# EasyEDA Pro project 转接板_v1_2024-09-18.eprj

# Schematic Schematic1
Create Date: 2024-09-18; Page Name: P1; Project Name: 转接板_v1_2024-09-18; Schematic Name: Schematic1; Update Date: 2024-09-18; Company: 嘉立创EDA; Page Size: A4; Version: V1.0
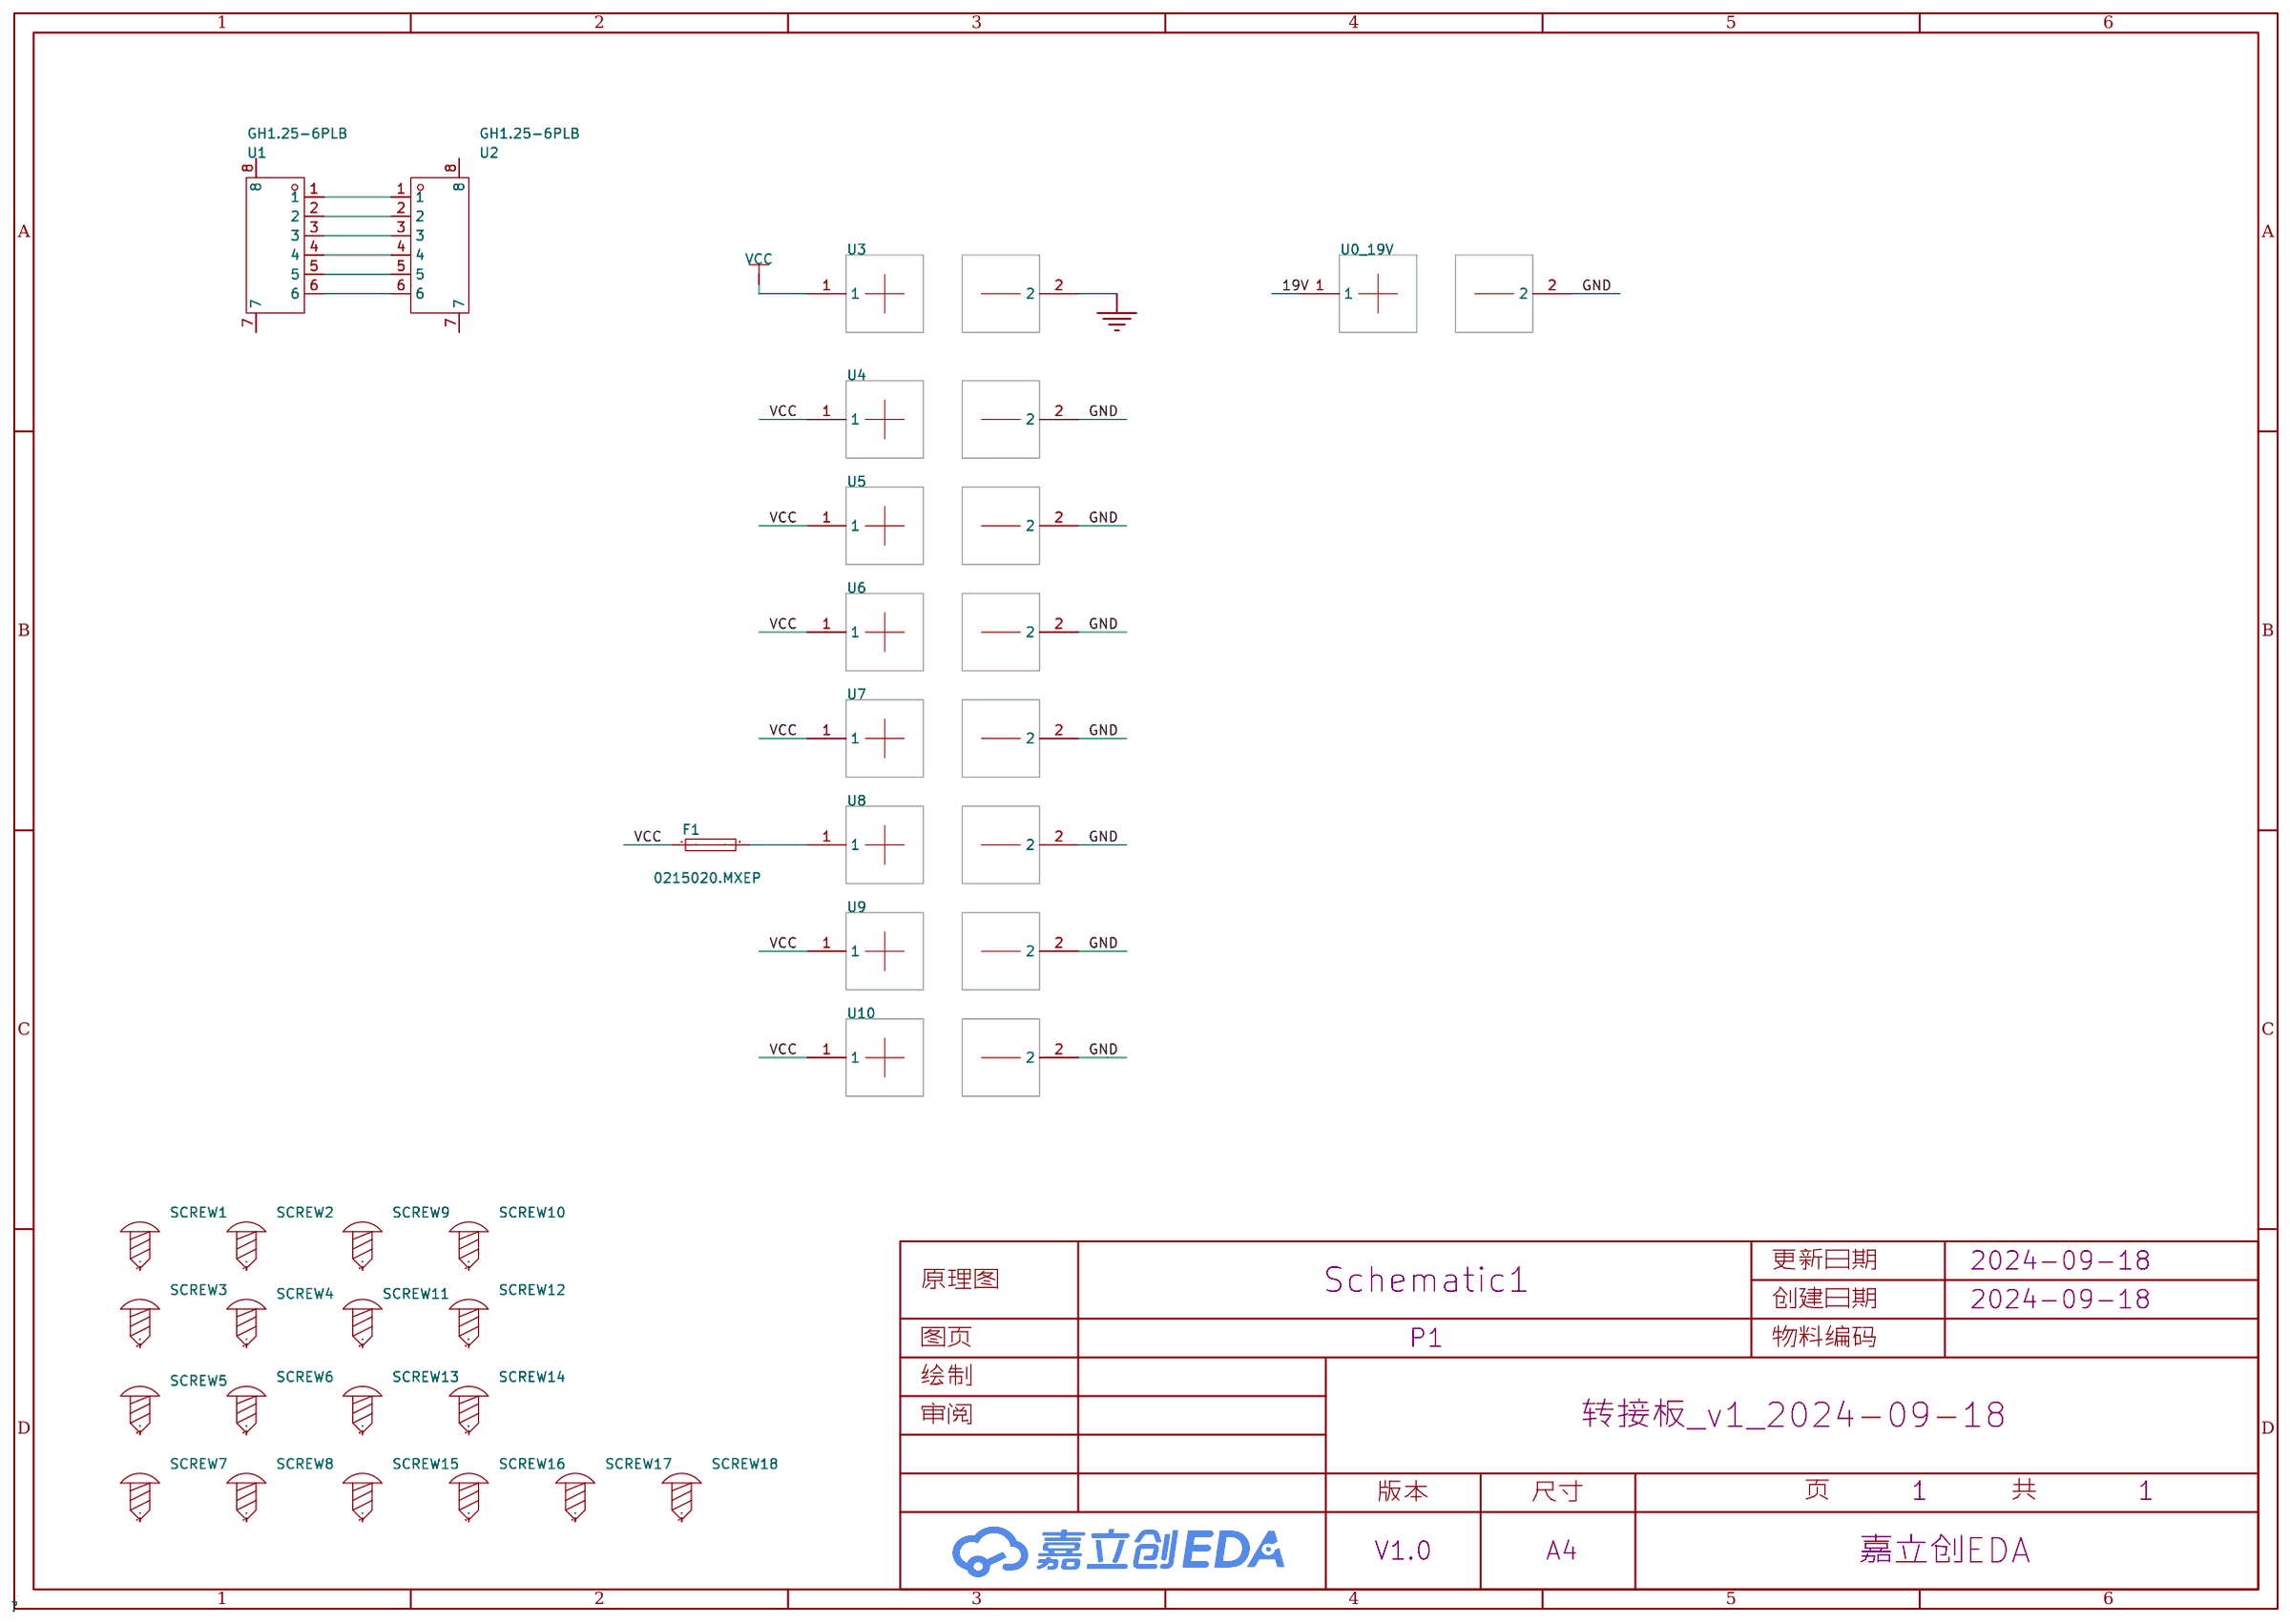
[diagram p0: schematic sheet]

## Parts
F1  0215020.MXEP  [FUSE-TH_BD5.5-L21.5-P25.50-D1.2]
SCREW1  -  [M3螺丝]
SCREW2  -  [M3螺丝]
SCREW3  -  [M3螺丝]
SCREW4  -  [M3螺丝]
SCREW5  -  [M3螺丝]
SCREW6  -  [M3螺丝]
SCREW7  -  [M3螺丝]
SCREW8  -  [M3螺丝]
SCREW9  -  [M3螺丝]
SCREW10  -  [M3螺丝]
SCREW11  -  [M3螺丝]
SCREW12  -  [M3螺丝]
SCREW13  -  [M3螺丝]
SCREW14  -  [M3螺丝]
SCREW15  -  [M3螺丝]
SCREW16  -  [M3螺丝]
SCREW17  -  [M3螺丝]
SCREW18  -  [M3螺丝]
U0_19V  -  [111]
U1  GH1.25-6PLB  [CONN-SMD_6P-P1.25_XUNPU_WAFER-GH1.25-6PLB]
U2  GH1.25-6PLB  [CONN-SMD_6P-P1.25_XUNPU_WAFER-GH1.25-6PLB]
U3  -  [111]
U4  -  [111]
U5  -  [111]
U6  -  [111]
U7  -  [111]
U8  -  [111]
U9  -  [111]
U10  -  [111]

## Library data of the parts
F1 = 0215020.MXEP: 类型:陶瓷管保险丝;额定电流:20A;; LCSC Part Name: 陶瓷管保险丝; Supplier Part: C151079; Manufacturer: Littelfuse(美国力特); Supplier Footprint: 插件,D5.8xL22.5mm; Datasheet: https://atta.szlcsc.com/upload/public/pdf/source/20180418/C178844_15D2AB09A5C0B365E956DEBA04888CB0.pdf; Supplier: LCSC; Type: 陶瓷管保险丝; Current Rating: 20A
SCREW1-SCREW18 = M3螺丝: Supplier Footprint: 插件
U0_19V U3-U10 = 111
U1 U2 = WAFER-GH1.25-6PLB: 插针结构:1x6P;间距:1.25mm;安装方式:立贴;参考系列:GH;总PIN数:6P;排数:1;每排PIN数:6;额定电流:1A;工作温度范围:-25℃~+85℃;; LCSC Part Name: 1x6P 间距:1.25mm 立贴 系列:GH; Supplier Part: C3029372; Manufacturer: XUNPU(讯普); Supplier Footprint: SMD,P=1.25mm; Datasheet: https://atta.szlcsc.com/upload/public/pdf/source/20220527/44F824AAC8C2B617205E15955FF9C23D.pdf; Supplier: LCSC; Pins Structure: 1x6P; Pitch: 1.25mm; Mounting Style: 立贴; Reference Series: GH; Number of Pins: 6P; Number of Rows: 1; Number of PINs Per Row: 6; Current Rating (Max): 1A; Operating Temperature Range: -25℃~+85℃

## Nets
19V: U0_19V.1
GND: U0_19V.2 U3.2 U4.2 U5.2 U6.2 U7.2 U8.2 U9.2 U10.2
VCC: F1.1 U3.1 U4.1 U5.1 U6.1 U7.1 U9.1 U10.1
$1N1535: U1.6 U2.6
$1N1536: U1.1 U2.1
$1N1537: U1.2 U2.2
$1N1538: U1.3 U2.3
$1N1539: U1.4 U2.4
$1N1540: U1.5 U2.5
$1N1987: F1.2 U8.1

Not connected (* = marked no-connect by the designer): SCREW1 1; SCREW2 1; SCREW3 1; SCREW4 1; SCREW5 1; SCREW6 1; SCREW7 1; SCREW8 1; SCREW9 1; SCREW10 1; SCREW11 1; SCREW12 1; SCREW13 1; SCREW14 1; SCREW15 1; SCREW16 1; SCREW17 1; SCREW18 1; U1 7 8; U2 7 8

# Board PCB1
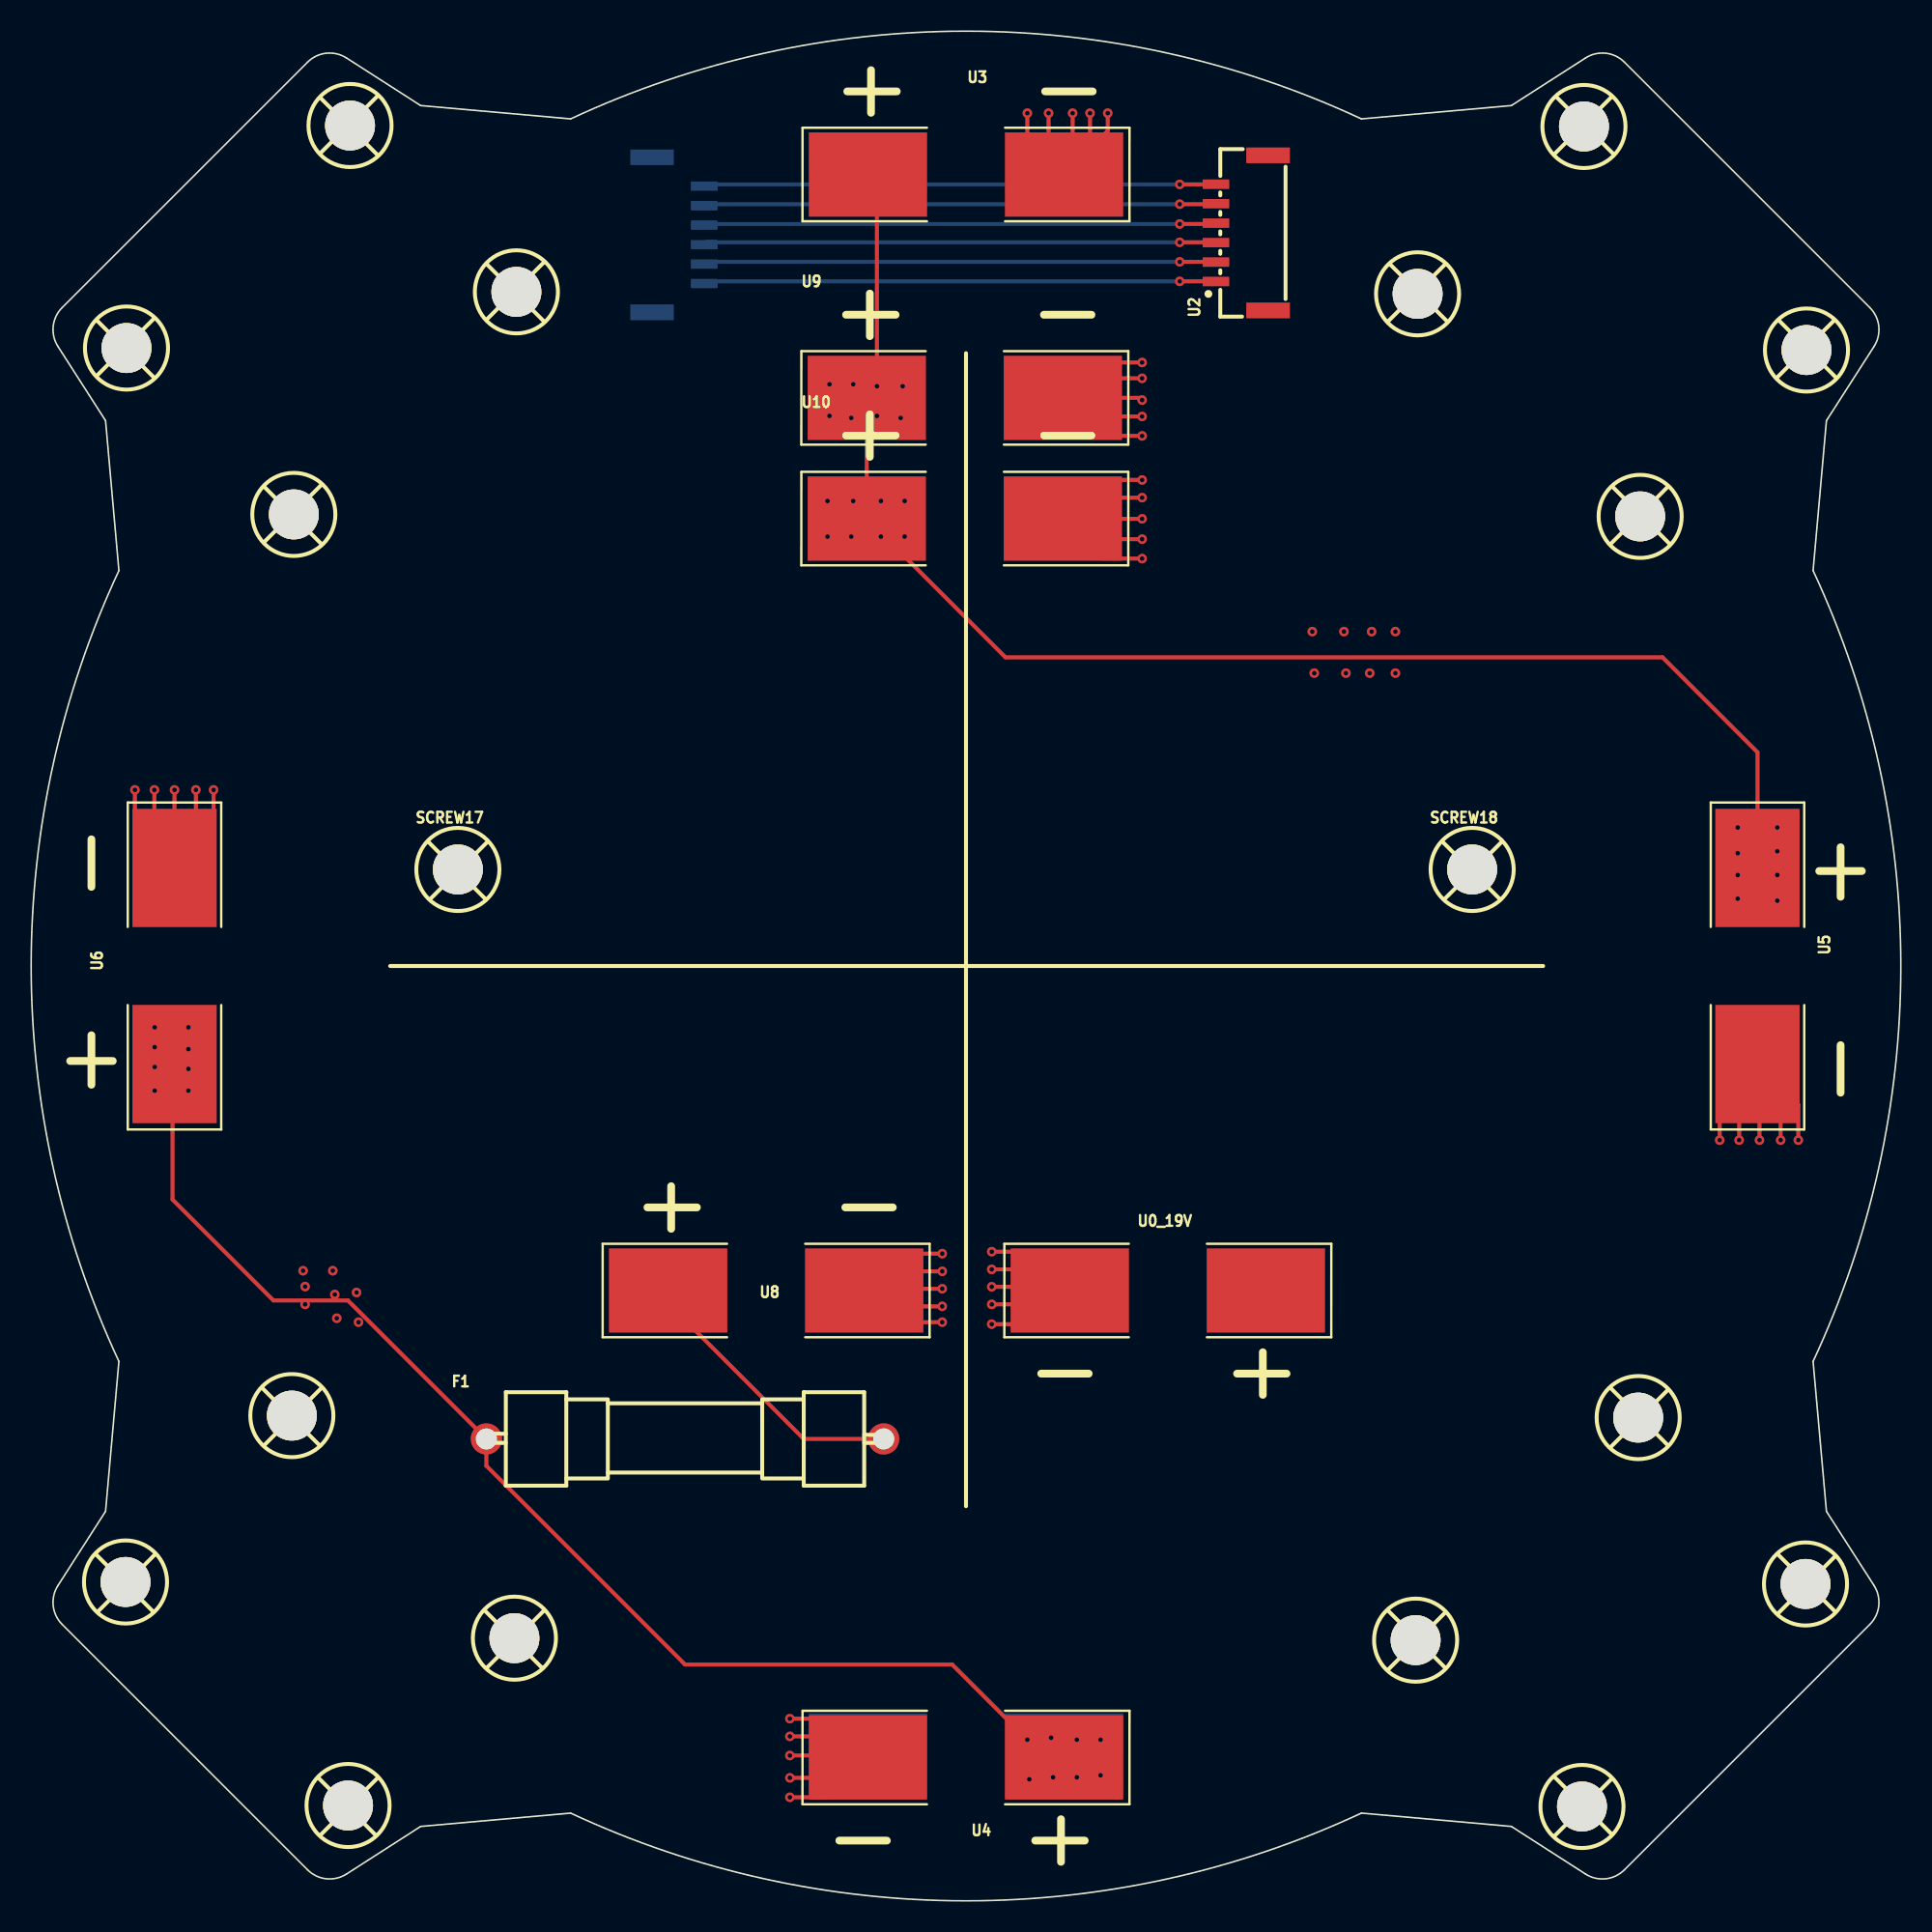
[diagram p1: board, top side]
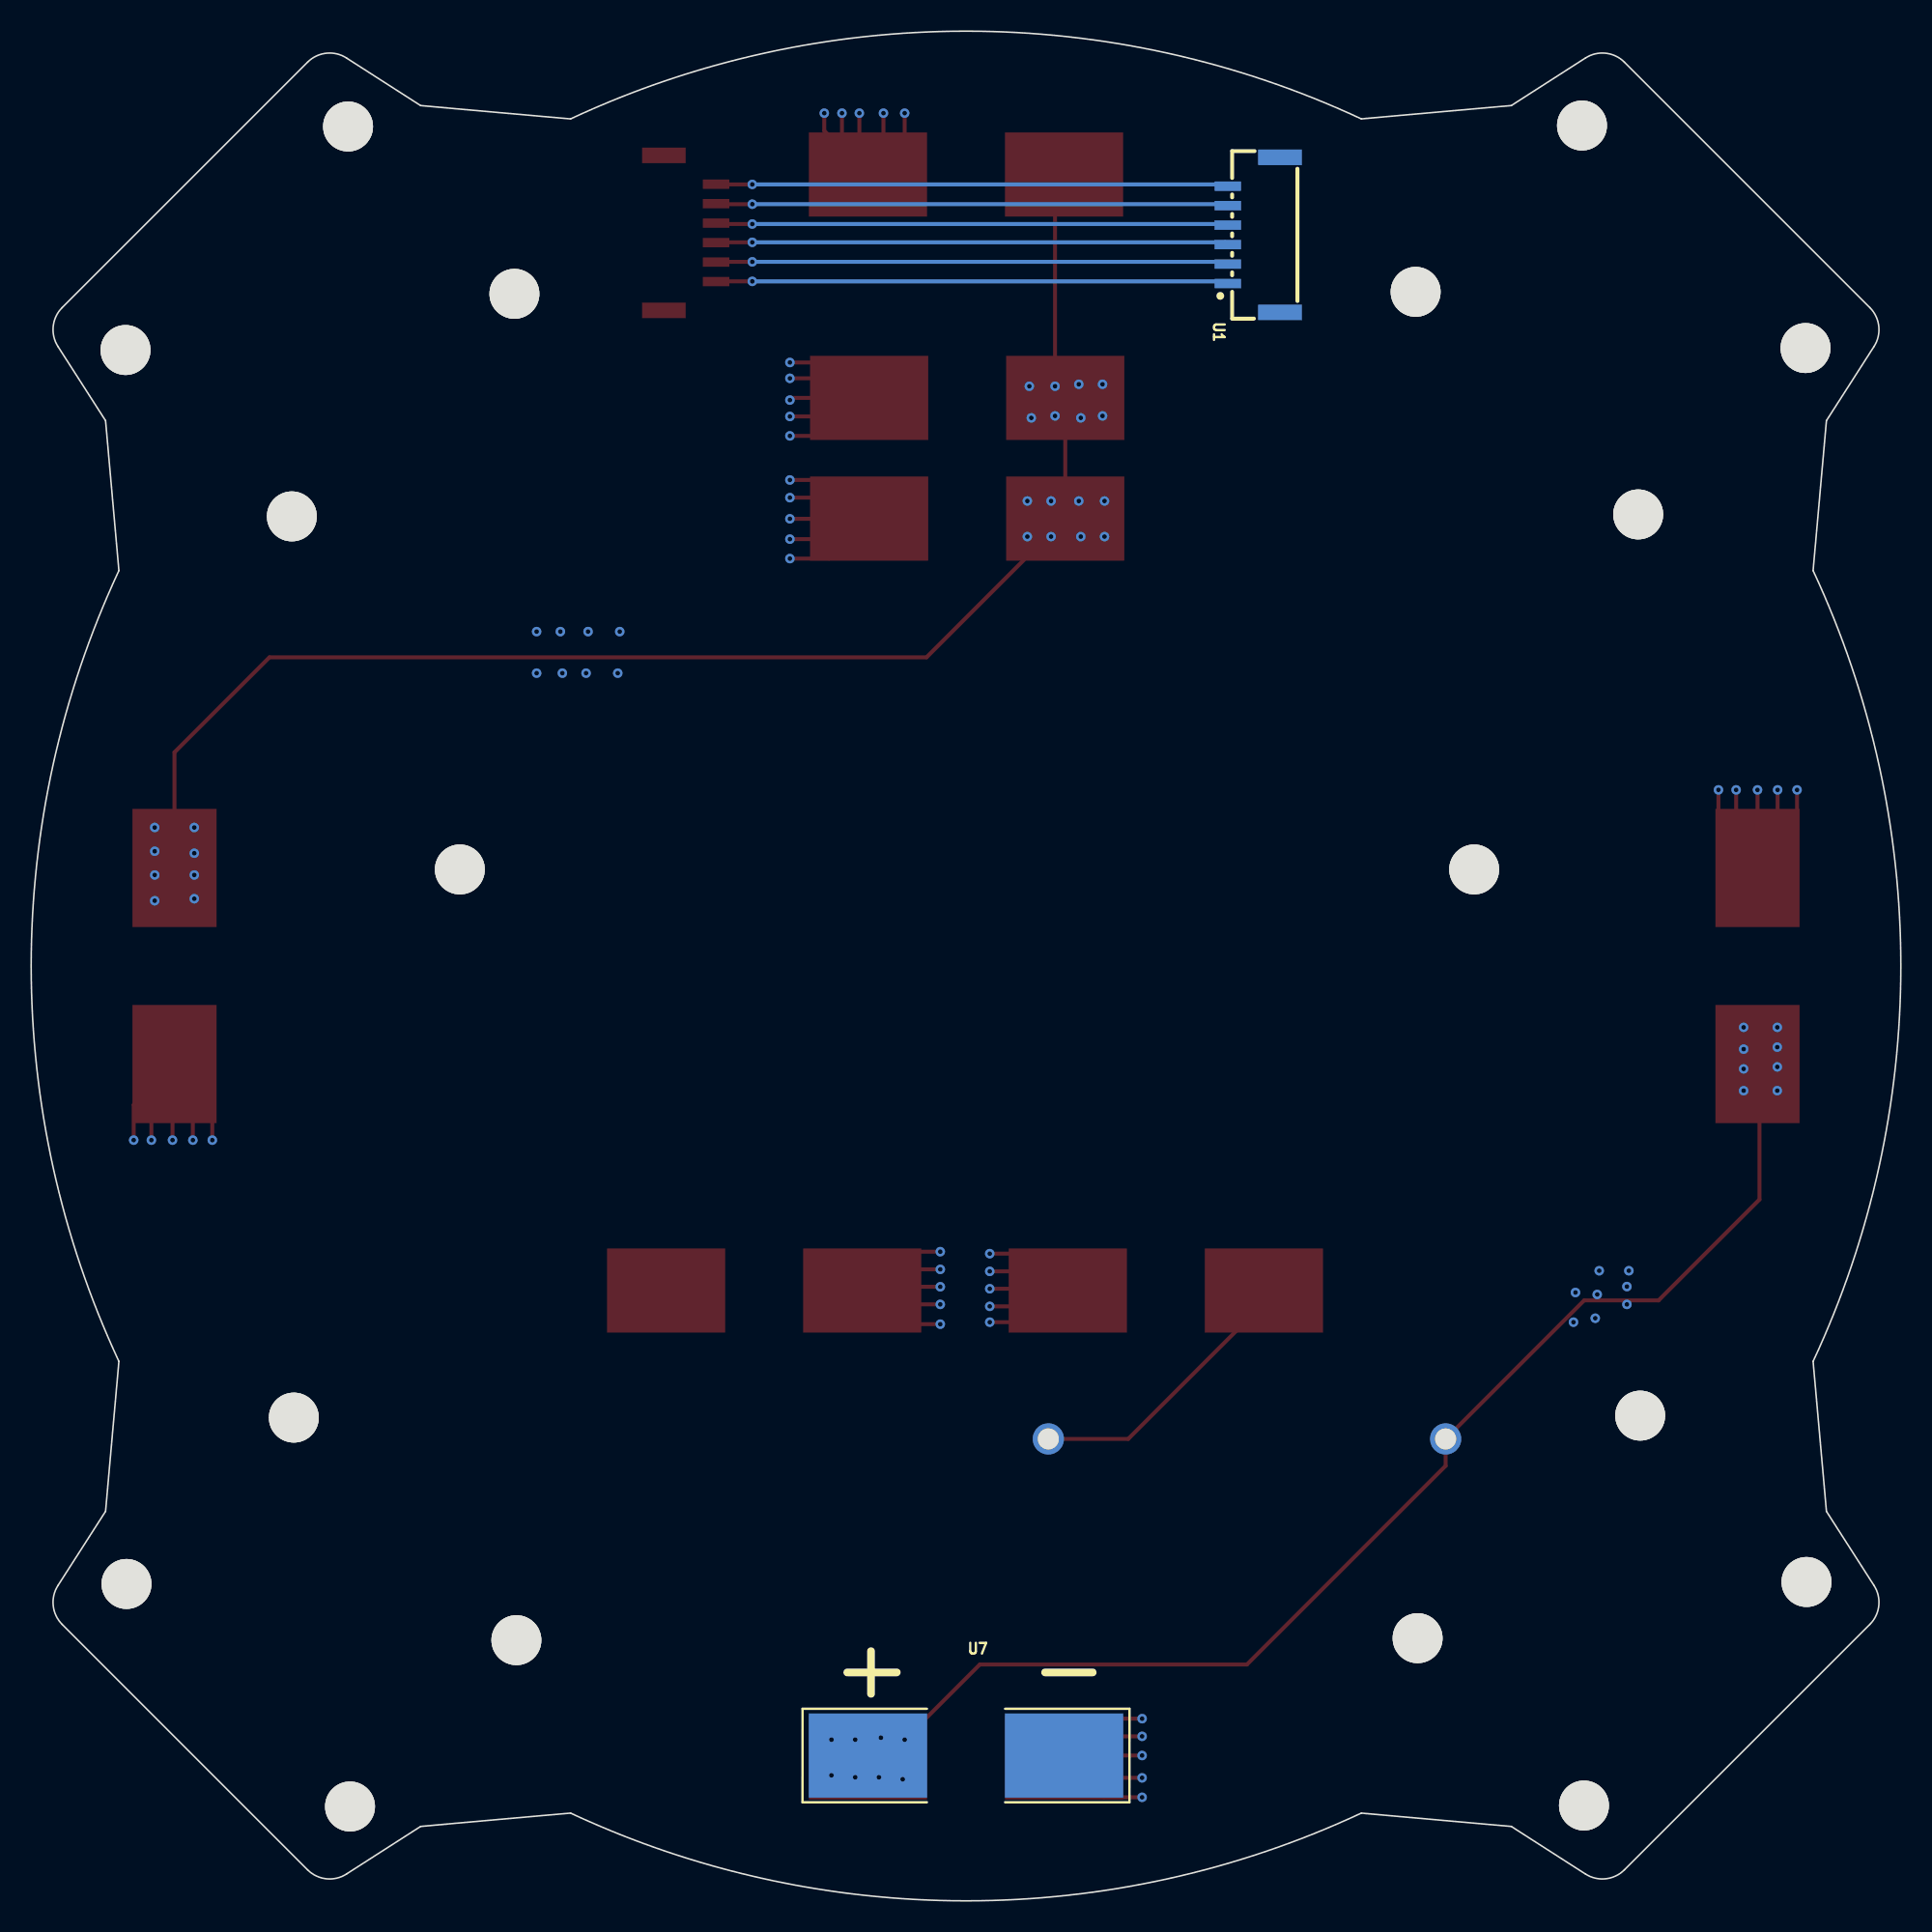
[diagram p2: board, bottom side, seen from below]

Outline 120 x 120 mm; copper layers: Top Layer, Bottom Layer. Coordinates in mm from the lower left corner of the outline.
Outline path: 1.72,99.76 arc(1.42,101.06) 1.99,102.26 17.74,118.01 arc(18.94,118.59) 20.24,118.28 25,115.23 34.62,114.37 arc(60,120) 85.38,114.37 95,115.23 99.76,118.28 arc(101.06,118.58) 102.26,118.01 118.01,102.26 arc(118.59,101.06) 118.28,99.76 115.23,95 114.37,85.38 arc(120,60) 114.37,34.62 115.23,25 118.28,20.24 arc(118.58,18.94) 118.01,17.74 102.26,1.99 arc(101.06,1.42) 99.76,1.72 95,4.78 85.38,5.63 arc(60,0) 34.62,5.63 25,4.78 20.24,1.72 arc(18.94,1.42) 17.74,1.99 1.99,17.74 arc(1.42,18.94) 1.72,20.24 4.78,25 5.63,34.62 arc(0,60) 5.63,85.38 4.78,95 1.72,99.76
Stack: Top Layer 0.035mm / Dielectric1 1.51mm FR4 er 4.5 / Bottom Layer 0.035mm

## Design rules (mm)
template: 自定义配置
spacing copperThickness1oz (default): track to track 0.102, other pairs 0.152 to 0.3
spacing copperThickness2oz: track to track 0.203, other pairs 0.152 to 0.3
track width copperThickness1oz (default): min 0.127, default 0.254, max 2.54
track width copperThickness2oz: min 0.203, default 0.254, max 2.54
differential pair differentialPair (default): width min 0.127, default 0.254, max 2.54; gap min 0.152, default 0.152
via viaSize (default): diameter min 0.5, default 0.61, max 10; hole min 0.3, default 0.305, max 6.3
net GND uses copperRegion2
net VCC uses copperRegion1
net $1N1987 uses copperRegion1

## Placement (name value [footprint] x y rotation side)
F1  0215020.MXEP  [FUSE-TH_BD5.5-L21.5-P25.50-D1.2]  41.97 29.65 0 top
SCREW1  -  [M3螺丝]  6.12 20.4 0 top
SCREW1#2  -  [M3螺丝]  99.6 6.12 90 top
SCREW1#3  -  [M3螺丝]  20.4 113.88 270 top
SCREW1#4  -  [M3螺丝]  113.88 99.6 180 top
SCREW4  -  [M3螺丝]  31.08 16.79 0 top
SCREW4#2  -  [M3螺丝]  103.21 31.08 90 top
SCREW4#3  -  [M3螺丝]  16.79 88.92 270 top
SCREW4#4  -  [M3螺丝]  88.92 103.21 180 top
SCREW6  -  [M3螺丝]  20.4 6.06 0 top
SCREW6#2  -  [M3螺丝]  113.94 20.4 90 top
SCREW6#3  -  [M3螺丝]  6.06 99.6 270 top
SCREW6#4  -  [M3螺丝]  99.6 113.94 180 top
SCREW8  -  [M3螺丝]  16.79 31.08 0 top
SCREW8#2  -  [M3螺丝]  88.92 16.79 90 top
SCREW8#3  -  [M3螺丝]  31.08 103.21 270 top
SCREW8#4  -  [M3螺丝]  103.21 88.92 180 top
SCREW17  -  [M3螺丝]  27.45 66.13 0 top
SCREW18  -  [M3螺丝]  92.55 66.13 0 top
U0_19V  -  [111]  72.95 39.17 180 top
U1  GH1.25-6PLB  [CONN-SMD_6P-P1.25_XUNPU_WAFER-GH1.25-6PLB]  41.52 106.93 90 bottom
U2  GH1.25-6PLB  [CONN-SMD_6P-P1.25_XUNPU_WAFER-GH1.25-6PLB]  77.72 107.05 90 top
U3  -  [111]  60 110.8 0 top
U4  -  [111]  60 9.2 180 top
U5  -  [111]  110.8 60 270 top
U6  -  [111]  9.2 60 90 top
U7  -  [111]  60 9.33 180 bottom
U8  -  [111]  47.17 39.17 0 top
U9  -  [111]  59.92 96.46 0 top
U10  -  [111]  59.92 88.72 0 top

## Footprints (pads in the part's own frame, mm; a bottom-side part is the same pattern mirrored in y, then rotated)
111
  rect 7.587x5.4 smd: 1(-6.293,0) 2(6.293,0)
CONN-SMD_6P-P1.25_XUNPU_WAFER-GH1.25-6PLB
  rect 0.6x1.7 smd: 1(-3.125,1.675) 2(-1.875,1.675) 3(-0.625,1.675) 4(0.625,1.675) 5(1.875,1.675) 6(3.125,1.675)
  rect 1x2.8 smd: 7(4.975,-1.675) 8(-4.975,-1.675)
FUSE-TH_BD5.5-L21.5-P25.50-D1.2
  round 2 hole 1.35: 1(-12.75,0) 2(12.75,0)
M3螺丝
  round 3.2 hole 3.2: 1(-0.064,0.064)

## Nets
As in the schematic.

Pads without a net: SCREW1 1; SCREW1#2 1; SCREW1#3 1; SCREW1#4 1; SCREW4 1; SCREW4#2 1; SCREW4#3 1; SCREW4#4 1; SCREW6 1; SCREW6#2 1; SCREW6#3 1; SCREW6#4 1; SCREW8 1; SCREW8#2 1; SCREW8#3 1; SCREW8#4 1; SCREW17 1; SCREW18 1; U1 7 8; U2 7 8

## Via types
v1: diameter 0.61, hole 0.305, Top Layer to Bottom Layer, 102 vias

## Routing (per net, layer and track width the routed paths; a pad name or vN(x,y) marks a point on that pad's centre or on a via; arc(x,y) is an arc through that point)
GND: length 189.5
  Top Layer w0.254: v1(48.7,6.65) 51.15,6.65 52.4,7.9 ; v1(58.48,39.29) 53.58,39.29 ; 53.58,39.29 54.7,40.4 ; 53.58,39.29 U8.2 54.74,37.9 ; v1(112.28,48.82) 112.28,52.22 ; 112.28,52.22 113.42,51.09 v1(113.42,48.82) ; 112.28,52.22 111.17,53.34 ; 67.54,87.4 68.78,86.15 v1(71.3,86.15) ; 67.54,87.4 v1(71.3,87.4) ; 67.54,87.4 U10.2 66.44,88.94 ; v1(65.3,114.74) 65.3,111.79 ; 65.3,111.79 U3.2 66.84,111.35 ; 65.3,111.79 63.94,113.16 v1(63.94,114.74) ; v1(61.65,39.41) 66.42,39.41 ; 66.42,39.41 U0_19V.2 65.65,38.16 ; 66.42,39.41 65.3,40.53 ; v1(48.7,9.33) 53.58,9.33 ; 53.58,9.33 U4.2 52.4,7.9 ; 53.58,9.33 52.35,10.56 ; 54.74,37.9 55.5,37.14 v1(58.48,37.14) ; 54.74,37.9 54.99,38.16 v1(58.48,38.16) ; 7.91,67.58 U6.2 ; 7.91,67.58 v1(7.91,71.3) ; 7.91,67.58 6.66,68.83 v1(6.66,71.3) ; U6.2 10.57,67.66 ; U6.2 v1(9.2,71.3) ; 67.96,112.47 66.84,111.35 ; 67.96,112.47 v1(67.96,114.74) ; 67.96,112.47 69.1,113.6 v1(69.1,114.74) ; 66.84,111.35 v1(66.84,114.74) ; 10.57,67.66 11.71,68.8 v1(11.71,71.3) ; 10.57,67.66 v1(10.57,71.3) ; v1(71.3,95.27) 67.41,95.27 ; 67.41,95.27 68.66,94.02 v1(71.3,94.02) ; 67.41,95.27 U9.2 ; v1(71.3,90.06) 67.56,90.06 ; 67.56,90.06 66.44,88.94 ; 67.56,90.06 68.7,91.2 v1(71.3,91.2) ; v1(48.7,11.69) 51.21,11.69 52.35,10.56 ; v1(61.65,40.53) 65.3,40.53 ; 65.3,40.53 64.17,41.67 v1(61.65,41.67) ; v1(61.65,37.01) 64.5,37.01 65.65,38.16 ; v1(71.3,96.32) 71.16,96.46 U9.2 ; 65.65,38.16 65.52,38.28 v1(61.65,38.28) ; 109.62,52.53 108.37,51.28 v1(108.37,48.82) ; 109.62,52.53 v1(109.62,48.82) ; 109.62,52.53 U5.2 111.17,53.34 ; 52.4,7.9 v1(48.7,7.9) ; v1(71.3,98.74) 68.49,98.74 67.47,97.72 ; 66.44,88.94 66.68,88.7 v1(71.3,88.7) ; 111.17,53.34 110.93,53.1 v1(110.93,48.82) ; v1(71.3,97.72) 67.47,97.72 ; 67.47,97.72 U9.2 ; 54.7,40.4 55.83,41.54 v1(58.48,41.54) ; 54.7,40.4 v1(58.48,40.4) ; 52.35,10.56 v1(48.7,10.56)
VCC: length 172.4
  Top Layer w0.254: v1(63.94,10.34) 59.11,15.17 41.97,15.17 29.22,27.92 F1.1 20.33,38.54 15.55,38.54 9.07,45.01 9.07,53.58 U6.1 ; U5.1 110.8,73.72 104.7,79.81 62.53,79.81 U10.1 U9.1 54.29,97.12 v1(54.29,97.21) 54.29,110.22 U3.1
  vias: v1(7.93,56.06) v1(7.93,54.79) v1(7.93,53.52) v1(7.93,52) v1(10.09,56.06) v1(10.09,54.67) v1(10.09,53.4) v1(10.09,52) v1(17.46,40.44) v1(17.58,39.43) v1(17.58,38.28) v1(19.36,40.44) v1(19.49,38.92) v1(19.61,37.39) v1(20.88,39.05) v1(21.01,37.14) v1(51.11,89.85) v1(51.11,87.56) v1(51.24,97.34) v1(51.24,95.31) v1(52.63,95.18) v1(52.63,87.56) v1(52.76,97.34) v1(52.76,89.85) v1(54.29,95.31) v1(54.54,89.85) v1(54.54,87.56) v1(55.81,95.18) v1(55.94,97.21) v1(56.06,89.85) v1(56.06,87.56) v1(64.06,7.8) v1(65.46,10.47) v1(65.59,7.93) v1(67.11,10.34) v1(67.11,7.93) v1(68.64,10.34) v1(68.64,8.06) v1(82.23,81.46) v1(82.35,78.8) v1(84.26,81.46) v1(84.38,78.8) v1(85.91,78.8) v1(86.04,81.46) v1(87.56,81.46) v1(87.56,78.8) v1(109.53,68.89) v1(109.53,67.24) v1(109.53,65.84) v1(109.53,64.32) v1(112.07,68.89) v1(112.07,67.37) v1(112.07,65.84) v1(112.07,64.19)
$1N1535: length 32.9
  Top Layer w0.254: U2.6 76.03,110.17 v1(73.72,110.17)
  Bottom Layer w0.254: U1.6 43.31,110.17 v1(73.72,110.17)
$1N1536: length 32.9
  Top Layer w0.254: v1(73.72,103.94) 76.03,103.94 U2.1
  Bottom Layer w0.254: U1.1 43.34,103.94 v1(73.72,103.94)
$1N1537: length 32.9
  Top Layer w0.254: v1(73.72,105.2) 76.03,105.2 U2.2
  Bottom Layer w0.254: U1.2 43.34,105.2 v1(73.72,105.2)
$1N1538: length 32.9
  Top Layer w0.254: U2.3 76.02,106.45 v1(73.72,106.45)
  Bottom Layer w0.254: U1.3 43.34,106.45 v1(73.72,106.45)
$1N1539: length 32.9
  Top Layer w0.254: U2.4 75.99,107.62 v1(73.72,107.62)
  Bottom Layer w0.254: v1(73.72,107.62) 43.27,107.62 U1.4
$1N1540: length 32.9
  Top Layer w0.254: U2.5 76.01,108.9 v1(73.72,108.9)
  Bottom Layer w0.254: v1(73.72,108.9) 43.29,108.9 U1.5
$1N1987: length 18.3
  Top Layer w0.254: F1.2 49.59,29.65 40.88,38.35 U8.1

## Copper pours and planes (outline as drawn; the poured copper is in the pictures)
GND on Top Layer: -68.9,152.84 173.67,152.84 173.67,-51.89 -68.9,-51.89
GND on Bottom Layer: -23.69,130.1 141.03,130.1 141.03,-10.48 -23.69,-10.48
VCC on Top Layer: 45.65,76.7 105.09,77.02 106.74,74.67 106.74,60.89 114.99,61.27 112.83,80.45 109.66,84 60.3,84 59.49,84.64 59.86,115.5 45.65,115.5
VCC on Top Layer: 5.01,58.1 5.01,45.74 9.84,39.17 16.57,36.63 40.95,13.39 58.98,13.39 60.89,11.49 60.89,4.76 61.02,4.63 71.56,4.63 72.32,5.39 72.32,13.14 68.38,17.07 44.25,17.07 19.49,41.84 15.55,41.84 14.03,43.36 14.03,57.46 12.88,58.6 5.52,58.6
VCC on Bottom Layer: 61.27,4.76 61.27,11.87 59.49,13.65 40.32,13.65 17.84,36.12 25.2,36.12 43.57,17.76 44.13,16.95 68.26,16.95 72.29,12.92 72.32,12.92 72.32,5.14 71.81,4.63 71.68,4.76
VCC on Bottom Layer: 47.11,100.64 58.35,100.64 58.6,100.39 58.6,85.15 60.38,83.37 109.15,83.37 112.45,78.8 114.48,62.03 114.23,60.89 106.74,60.89 106.74,73.84 106.61,73.97 106.61,75.62 105.34,76.89 55.81,76.89 52.51,73.59 52.51,63.22 49.23,63.22 36.12,63.4 36.63,91.88
VCC on Bottom Layer: 4.88,57.84 13.65,57.84 13.9,57.59 13.9,42.98 17.07,42.97 20.47,42.97 37.79,66.9 52,66.6 52.38,66.22 52.23,63.04 33.27,40.36 27.06,34.98 12.96,34.98 6.15,44.13
$1N1987 on Top Layer: 45.14,28.38 55.68,28.38 55.68,32.51 54.41,32.7 48.06,33.2 44.76,36.89 44.76,38.66 37.01,38.66 37.01,36.51

Small or netless copper shapes (teardrops, artwork), in the pictures only: 1 on Bottom Layer
